# EAGLE schematic Reflow Oven Other Circuits (EAGLE 6.5.0)
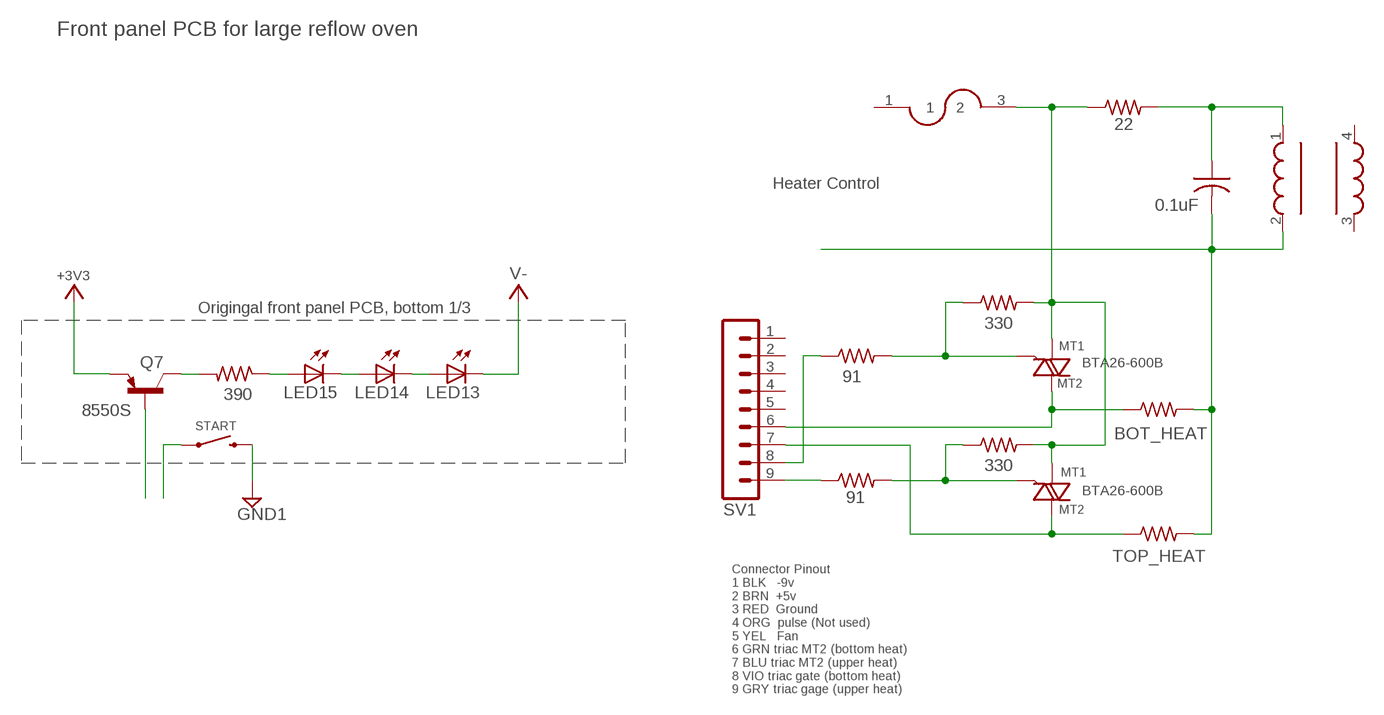
[diagram p0: schematic, sheet 1]

## Parts
BOT_HEAT  R-US_0207/10  [0207/10]
C2  0.1uF  C-US050-030X075  [C050-030X075]
F3  FUSEX20MM  [FUSE_5MM]
LED13  LED5MM  [LED5MM]
LED14  LED5MM  [LED5MM]
LED15  LED5MM  [LED5MM]
Q7  8550S  BC327-40-PNP-TO92-EBC  [TO92-EBC]
R1  390  R-US_0207/10  [0207/10]
R6  22  R-US_0207/10  [0207/10]
R7  91  R-US_0207/10  [0207/10]
R8  91  R-US_0207/10  [0207/10]
R9  330  R-US_0207/10  [0207/10]
R10  330  R-US_0207/10  [0207/10]
START  SWITCH-MOMENTARY-2PTH  [TACTILE-PTH]
SV1  MA09-1  [MA09-1]
T1  BTA26-600B  BTA26-H  [TOP3L-1]
T2  BTA26-600B  BTA26-H  [TOP3L-1]
TOP_HEAT  R-US_0207/10  [0207/10]
U$1  TRANSFORMERPTH  [TRANSFORMER]

## Nets
+3V3: Q7.E
GND1: START.3
GRAY: R8.1 SV1.9
N$7: C2.1 R6.2 U$1.1
N$8: R7.2 R9.1 T1.G
N$10: R8.2 R10.1 T2.G
N$12: BOT_HEAT.1 SV1.6 T1.A2
N$13: SV1.7 T2.A2 TOP_HEAT.1
N$14: LED13.A LED14.K(C)
N$15: LED14.A LED15.K(C)
N$16: F3.3 R6.1 R9.2 R10.2 T1.A1 T2.A1
N$17: START.1
N$18: R7.1 SV1.8
N$19: Q7.B
N$24: LED15.A R1.1
N$25: Q7.C R1.2
NEUTRAL: BOT_HEAT.2 C2.2 TOP_HEAT.2 U$1.2
V-: LED13.K(C)
Unconnected: F3.1 SV1.1 SV1.2 SV1.3 SV1.4 SV1.5 U$1.3 U$1.4

## Notes on the sheet
- Front panel PCB for large reflow oven
- Heater Control
- Origingal front panel PCB, bottom 1/3
- MT1
- MT2
- MT1
- MT2
- Connector Pinout
  1 BLK   -9v
  2 BRN  +5v
  3 RED  Ground
  4 ORG  pulse (Not used)
  5 YEL   Fan
  6 GRN triac MT2 (bottom heat)
  7 BLU triac MT2 (upper heat)
  8 VIO triac gate (bottom heat)
  9 GRY triac gage (upper heat)

## Library data of the parts
BOT_HEAT R1 R6-R10 TOP_HEAT = rcl:R-US_: RESISTOR, American symbol
C2 = rcl:C-US: CAPACITOR, American symbol
F3 = SparkFun-Passives:FUSE
LED13-LED15 = SparkFun-LED:LED: LEDs Standard schematic elements and footprints for 5mm, 3mm, 1206, and 0603 sized LEDs. 5mm - Spark Fun Electronics SKU : COM-00529 (and others)
Q7 = transistor:*-PNP-: PNP Transistror
START = SparkFun-Electromechanical:SWITCH-MOMENTARY-2: Various NO switches- pushbuttons, reed, etc
SV1 = con-lstb:MA09-1: PIN HEADER; OC_FARNELL: unknown; OC_NEWARK: unknown
T1 T2 = triac:BTA26: 25A TRIAC Source: http://www.st.com/stonline/products/literature/ds/7470.pdf
U$1 = SparkFun-PowerIC:TRANSFORMER: Small transformers